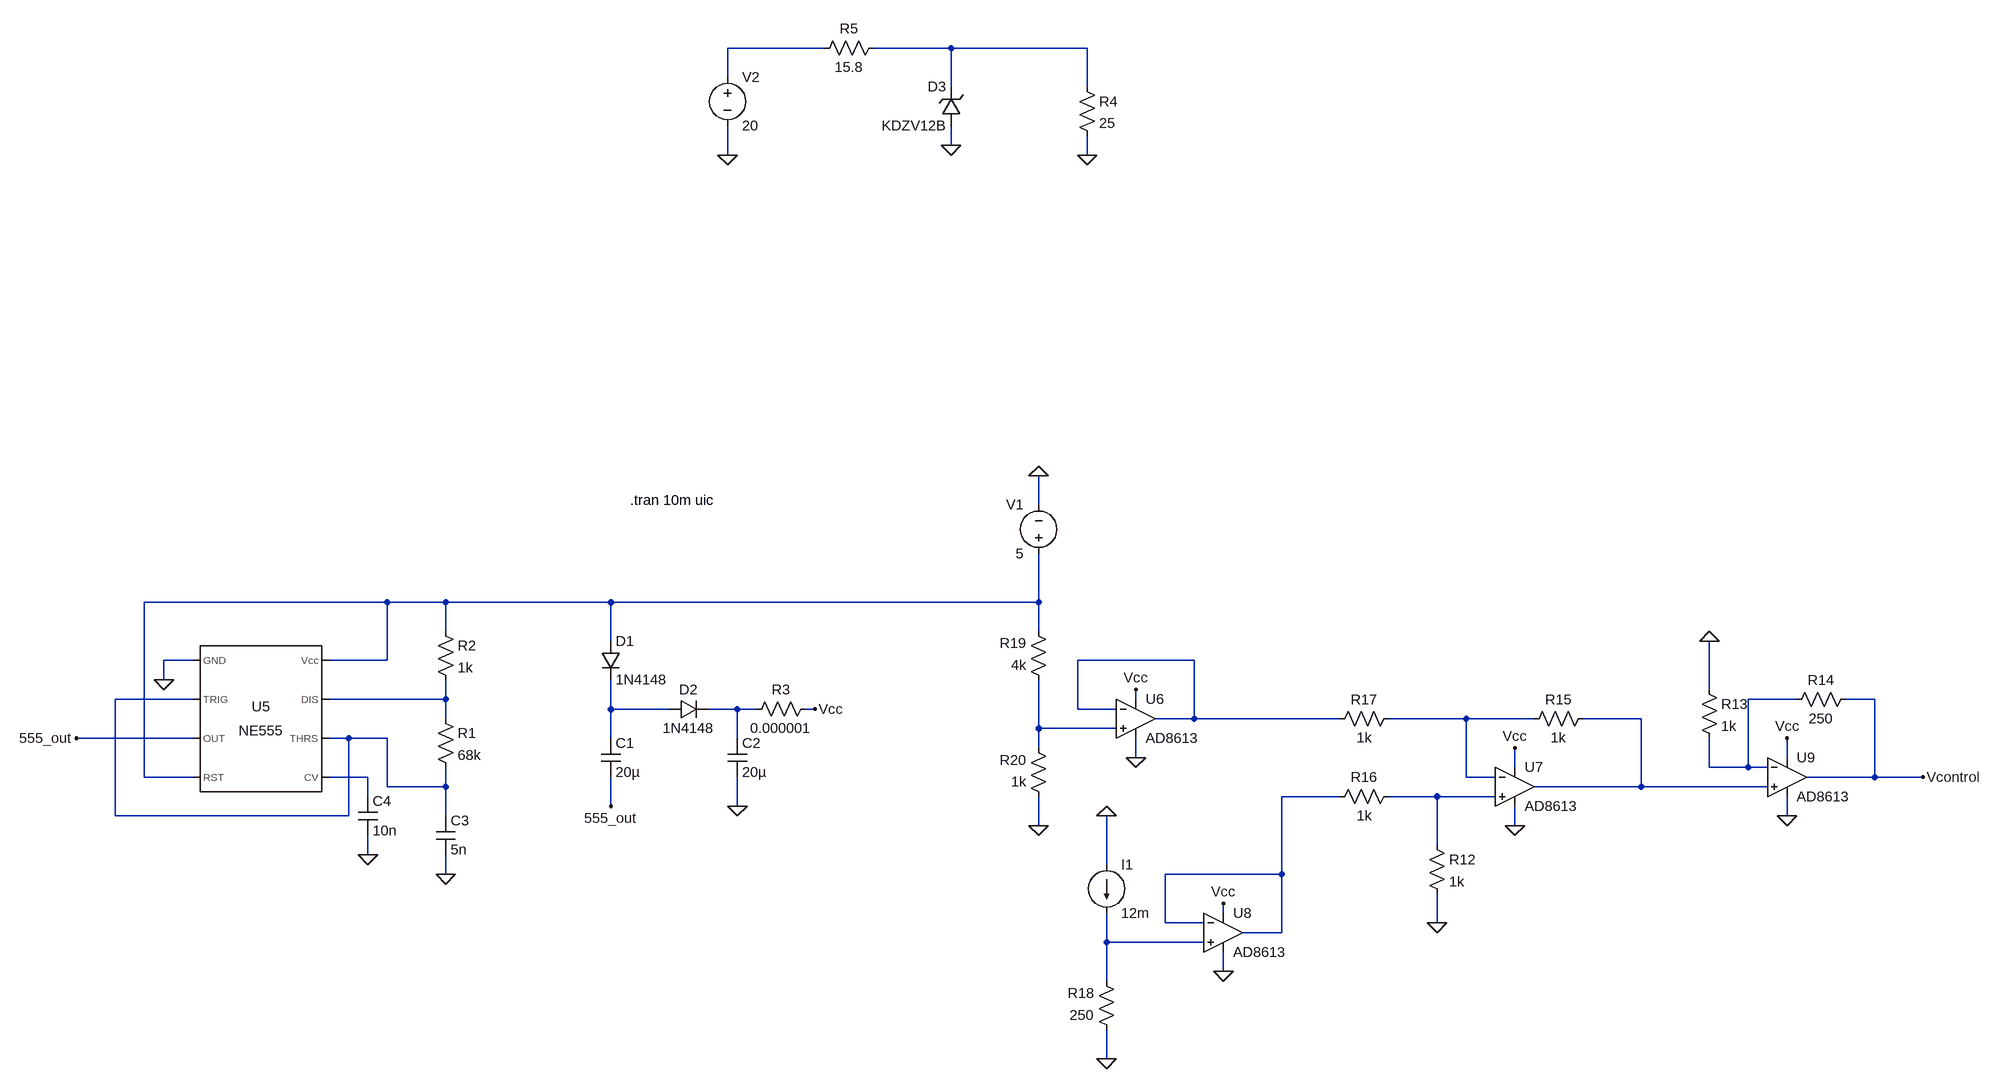
[diagram p0: schematic AmpOp_Optimal.asc]
AmpOp_Optimal.asc, the LTspice schematic file:
Version 4
SHEET 1 5272 1508
WIRE -1472 -560 -1632 -560
WIRE -1264 -560 -1392 -560
WIRE -1040 -560 -1264 -560
WIRE -1632 -512 -1632 -560
WIRE -1264 -496 -1264 -560
WIRE -1040 -496 -1040 -560
WIRE -1264 -400 -1264 -432
WIRE -1632 -384 -1632 -432
WIRE -1040 -384 -1040 -416
WIRE -1120 192 -1120 144
WIRE -2192 352 -2592 352
WIRE -2096 352 -2192 352
WIRE -1824 352 -2096 352
WIRE -1120 352 -1120 272
WIRE -1120 352 -1824 352
WIRE -2096 400 -2096 352
WIRE -1120 400 -1120 352
WIRE -1824 416 -1824 352
WIRE -2512 448 -2560 448
WIRE -2192 448 -2192 352
WIRE -2192 448 -2288 448
WIRE -864 448 -1056 448
WIRE -2560 480 -2560 448
WIRE -16 496 -16 416
WIRE -2512 512 -2640 512
WIRE -2096 512 -2096 480
WIRE -2096 512 -2288 512
WIRE -960 512 -960 496
WIRE 128 512 48 512
WIRE 256 512 208 512
WIRE -1824 528 -1824 480
WIRE -1728 528 -1824 528
WIRE -1616 528 -1664 528
WIRE -1584 528 -1616 528
WIRE -1488 528 -1504 528
WIRE -1056 528 -1056 448
WIRE -992 528 -1056 528
WIRE -2096 544 -2096 512
WIRE -864 544 -864 448
WIRE -864 544 -928 544
WIRE -624 544 -864 544
WIRE -416 544 -544 544
WIRE -304 544 -416 544
WIRE -128 544 -224 544
WIRE -1120 560 -1120 480
WIRE -992 560 -1120 560
WIRE -2512 576 -2704 576
WIRE -2256 576 -2288 576
WIRE -2192 576 -2256 576
WIRE -1824 576 -1824 528
WIRE -1616 576 -1616 528
WIRE -1120 592 -1120 560
WIRE -960 608 -960 576
WIRE 112 608 112 576
WIRE -336 624 -336 592
WIRE -16 624 -16 576
WIRE 48 624 48 512
WIRE 48 624 -16 624
WIRE 80 624 48 624
WIRE -2592 640 -2592 352
WIRE -2512 640 -2592 640
WIRE -2224 640 -2288 640
WIRE -416 640 -416 544
WIRE -368 640 -416 640
WIRE 256 640 256 512
WIRE 256 640 144 640
WIRE 336 640 256 640
WIRE -2192 656 -2192 576
WIRE -2096 656 -2096 624
WIRE -2096 656 -2192 656
WIRE -128 656 -128 544
WIRE -128 656 -304 656
WIRE 80 656 -128 656
WIRE -2224 672 -2224 640
WIRE -624 672 -720 672
WIRE -464 672 -544 672
WIRE -368 672 -464 672
WIRE -1824 688 -1824 640
WIRE -1616 688 -1616 640
WIRE -2640 704 -2640 512
WIRE -2256 704 -2256 576
WIRE -2256 704 -2640 704
WIRE -2096 704 -2096 656
WIRE 112 704 112 672
WIRE -1120 720 -1120 672
WIRE -336 720 -336 688
WIRE -464 752 -464 672
WIRE -2224 768 -2224 736
WIRE -1008 784 -1008 704
WIRE -2096 800 -2096 768
WIRE -720 800 -720 672
WIRE -720 800 -912 800
WIRE -816 864 -816 848
WIRE -912 880 -912 800
WIRE -848 880 -912 880
WIRE -464 880 -464 832
WIRE -720 896 -720 800
WIRE -720 896 -784 896
WIRE -1008 912 -1008 864
WIRE -848 912 -1008 912
WIRE -816 960 -816 928
WIRE -1008 976 -1008 912
WIRE -1008 1104 -1008 1056
FLAG -1120 720 0
FLAG -1008 1104 0
FLAG -464 880 0
FLAG -16 416 0
FLAG -1008 704 0
FLAG -816 848 Vcc
FLAG -336 592 Vcc
FLAG 112 576 Vcc
FLAG -960 608 0
FLAG -816 960 0
FLAG -336 720 0
FLAG 112 704 0
FLAG -1616 688 0
FLAG -2096 800 0
FLAG -2560 480 0
FLAG -2224 768 0
FLAG -960 496 Vcc
FLAG -2704 576 555_out
FLAG -1824 688 555_out
FLAG -1120 144 0
FLAG -1488 528 Vcc
FLAG 336 640 Vcontrol
FLAG -1632 -384 0
FLAG -1264 -400 0
FLAG -1040 -384 0
SYMBOL res -480 736 R0
SYMATTR InstName R12
SYMATTR Value 1k
SYMBOL res -32 480 R0
SYMATTR InstName R13
SYMATTR Value 1k
SYMBOL res 224 496 R90
WINDOW 0 0 56 VBottom 2
WINDOW 3 32 56 VTop 2
SYMATTR InstName R14
SYMATTR Value 250
SYMBOL res -208 528 R90
WINDOW 0 0 56 VBottom 2
WINDOW 3 32 56 VTop 2
SYMATTR InstName R15
SYMATTR Value 1k
SYMBOL res -528 656 R90
WINDOW 0 0 56 VBottom 2
WINDOW 3 32 56 VTop 2
SYMATTR InstName R16
SYMATTR Value 1k
SYMBOL res -528 528 R90
WINDOW 0 0 56 VBottom 2
WINDOW 3 32 56 VTop 2
SYMATTR InstName R17
SYMATTR Value 1k
SYMBOL res -992 1072 R180
WINDOW 0 36 76 Left 2
WINDOW 3 36 40 Left 2
SYMATTR InstName R18
SYMATTR Value 250
SYMBOL res -1104 496 R180
WINDOW 0 36 76 Left 2
WINDOW 3 36 40 Left 2
SYMATTR InstName R19
SYMATTR Value 4k
SYMBOL res -1104 688 R180
WINDOW 0 36 76 Left 2
WINDOW 3 36 40 Left 2
SYMATTR InstName R20
SYMATTR Value 1k
SYMBOL current -1008 784 R0
WINDOW 123 0 0 Left 0
WINDOW 39 0 0 Left 0
SYMATTR InstName I1
SYMATTR Value 12m
SYMBOL diode -1840 416 R0
SYMATTR InstName D1
SYMATTR Value 1N4148
SYMBOL diode -1728 544 R270
WINDOW 0 32 32 VTop 2
WINDOW 3 0 32 VBottom 2
SYMATTR InstName D2
SYMATTR Value 1N4148
SYMBOL cap -1840 576 R0
SYMATTR InstName C1
SYMATTR Value 20µ
SYMBOL cap -1632 576 R0
SYMATTR InstName C2
SYMATTR Value 20µ
SYMBOL Misc\\NE555 -2400 544 R0
SYMATTR InstName U5
SYMBOL res -2112 528 R0
SYMATTR InstName R1
SYMATTR Value 68k
SYMBOL res -2112 384 R0
SYMATTR InstName R2
SYMATTR Value 1k
SYMBOL cap -2112 704 R0
SYMATTR InstName C3
SYMATTR Value 5n
SYMBOL cap -2240 672 R0
SYMATTR InstName C4
SYMATTR Value 10n
SYMBOL OpAmps\\AD8613 -960 480 R0
SYMATTR InstName U6
SYMBOL OpAmps\\AD8613 -336 592 R0
SYMATTR InstName U7
SYMBOL OpAmps\\AD8613 -816 832 R0
SYMATTR InstName U8
SYMBOL OpAmps\\AD8613 112 576 R0
SYMATTR InstName U9
SYMBOL res -1488 512 R90
WINDOW 0 0 56 VBottom 2
WINDOW 3 32 56 VTop 2
SYMATTR InstName R3
SYMATTR Value 0.000001
SYMBOL voltage -1120 288 R180
WINDOW 0 24 96 Left 2
WINDOW 3 24 16 Left 2
WINDOW 123 0 0 Left 0
WINDOW 39 0 0 Left 0
SYMATTR InstName V1
SYMATTR Value 5
SYMBOL voltage -1632 -528 R0
WINDOW 123 0 0 Left 0
WINDOW 39 0 0 Left 0
SYMATTR InstName V2
SYMATTR Value 20
SYMBOL res -1056 -512 R0
SYMATTR InstName R4
SYMATTR Value 25
SYMBOL res -1376 -576 R90
WINDOW 0 0 56 VBottom 2
WINDOW 3 32 56 VTop 2
SYMATTR InstName R5
SYMATTR Value 15.8
SYMBOL zener -1248 -432 R180
WINDOW 0 24 64 Left 2
WINDOW 3 24 0 Left 2
SYMATTR InstName D3
SYMATTR Value KDZV12B
SYMATTR Description Diode
SYMATTR Type diode
TEXT -1792 184 Left 2 !.tran 10m uic

The netlist it stands for:
* AmpOp_Optimal.asc
R12 N015 0 1k
R13 0 N007 1k
R14 Vcontrol N007 250
R15 N011 N010 1k
R16 N015 N014 1k
R17 N010 N004 1k
R18 0 N016 250
R19 N012 N003 4k
R20 0 N012 1k
I1 0 N016 12m
D1 N003 N008 1N4148
D2 N008 N009 1N4148
C1 N008 555_out 20µ
C2 N009 0 20µ
XU5 0 N005 555_out N003 N013 N005 N006 N003 NE555  ; pins GND TRIG OUT RST CV THRS DIS Vcc
R1 N006 N005 68k
R2 N003 N006 1k
C3 N005 0 5n
C4 N013 0 10n
XU6 N012 N004 Vcc 0 N004 AD8613  ; pins In+ In- V+ V- OUT
XU7 N015 N010 Vcc 0 N011 AD8613  ; pins In+ In- V+ V- OUT
XU8 N016 N014 Vcc 0 N014 AD8613  ; pins In+ In- V+ V- OUT
XU9 N011 N007 Vcc 0 Vcontrol AD8613  ; pins In+ In- V+ V- OUT
R3 Vcc N009 0.000001
V1 N003 0 5
V2 N001 0 20
R4 N002 0 25
R5 N002 N001 15.8
D3 0 N002 KDZV12B
.model D D
.lib standard.dio
.tran 10m uic
.lib NE555.sub
.backanno
.end